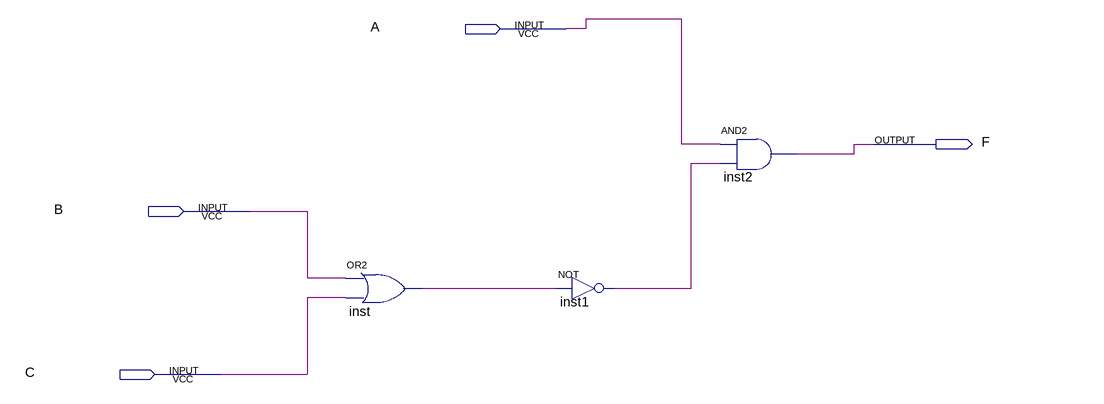
[diagram p0: schematic sheet]
// Quartus schematic fatih1.bdf as structural Verilog: 3 symbols, 4 pins
module fatih1 (
  input  A,
  input  B,
  input  C,
  output F
);

  wire inst1_out, inst_out;

  or inst (inst_out, B, C);
  not inst1 (inst1_out, inst_out);
  and inst2 (F, A, inst1_out);
endmodule
